# EAGLE design motorBoard (EAGLE 8.2.0)
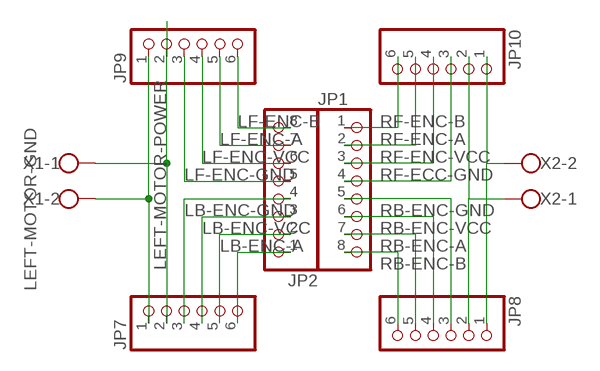
[diagram p0: schematic, sheet 1]

## Parts
JP1  PINHD-1X8  [1X08]
JP2  PINHD-1X8  [1X08]
JP7  PINHD-1X6  [1X06]
JP8  PINHD-1X6  [1X06]
JP9  PINHD-1X6  [1X06]
JP10  PINHD-1X6  [1X06]
X1  W237-102  [W237-102]
X2  W237-102  [W237-102]

## Nets
LB-ENC-A: JP2.2 JP7.5
LB-ENC-B: JP2.1 JP7.6
LB-ENC-GND: JP2.4 JP7.3
LB-ENC-VCC: JP2.3 JP7.4
LEFT-MOTOR-GND: JP7.2 JP9.2 X1.1
LEFT-MOTOR-POWER: JP7.1 JP9.1 X1.2
LF-ENC-A: JP2.7 JP9.5
LF-ENC-B: JP2.8 JP9.6
LF-ENC-GND: JP2.5 JP9.3
LF-ENC-VCC: JP2.6 JP9.4
N$1: JP8.1 JP10.1 X2.2
N$2: JP8.2 JP10.2 X2.1
RB-ENC-A: JP1.7 JP8.5
RB-ENC-B: JP1.8 JP8.6
RB-ENC-GND: JP1.5 JP8.3
RB-ENC-VCC: JP1.6 JP8.4
RF-ECC-GND: JP1.4 JP10.3
RF-ENC-A: JP1.2 JP10.5
RF-ENC-B: JP1.1 JP10.6
RF-ENC-VCC: JP1.3 JP10.4

## Library data of the parts
JP1 JP2 = pinhead:PINHD-1X8: PIN HEADER
JP7-JP10 = pinhead:PINHD-1X6: PIN HEADER
X1 X2 = con-wago-500:W237-102: WAGO SCREW CLAMP; MPN: 237-102; OC_FARNELL: unknown; OC_NEWARK: 70K9898

## Board
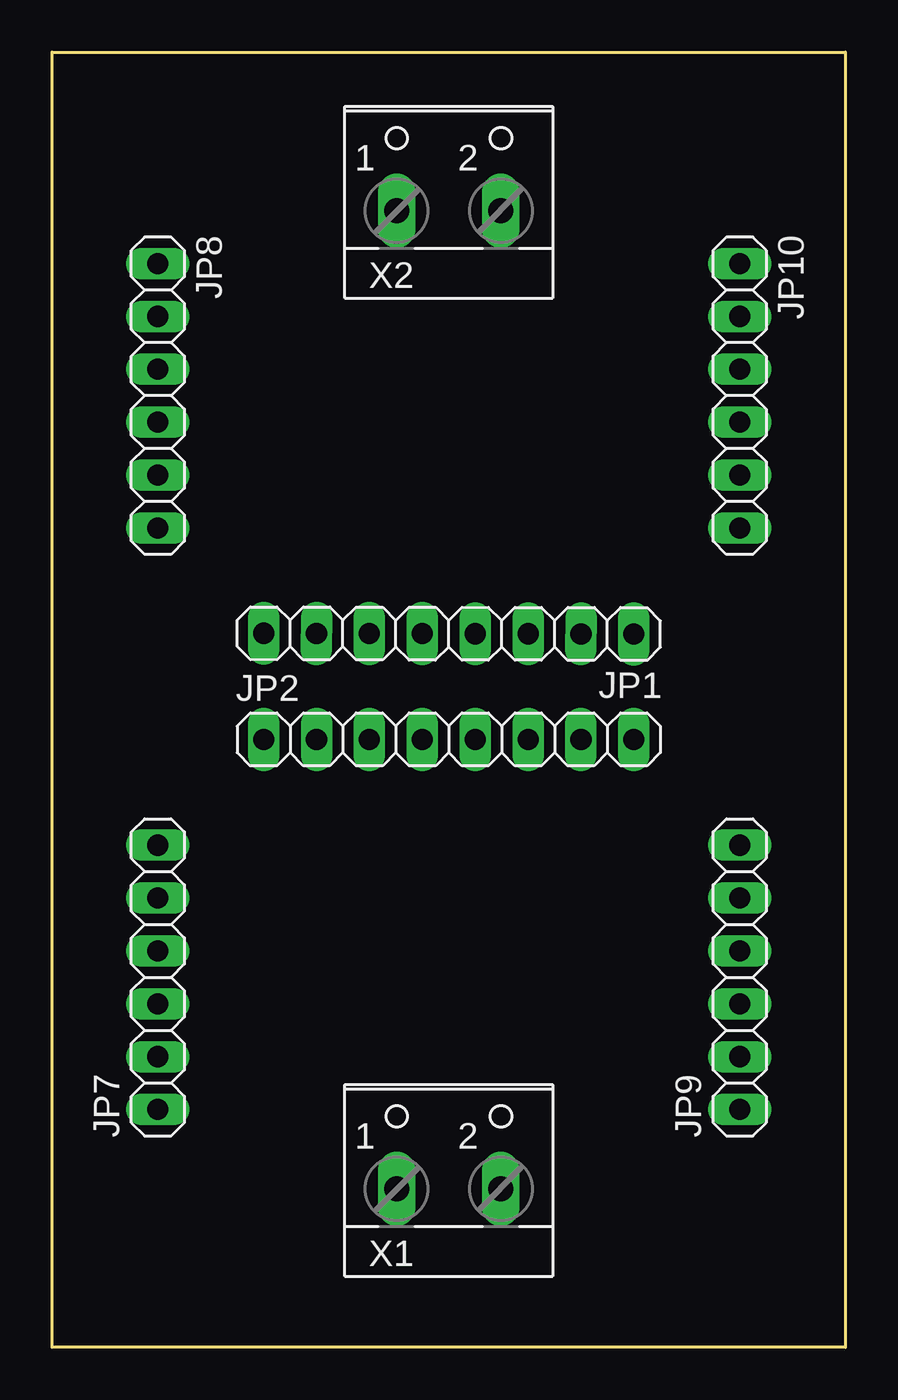
[diagram p1: board, top side]
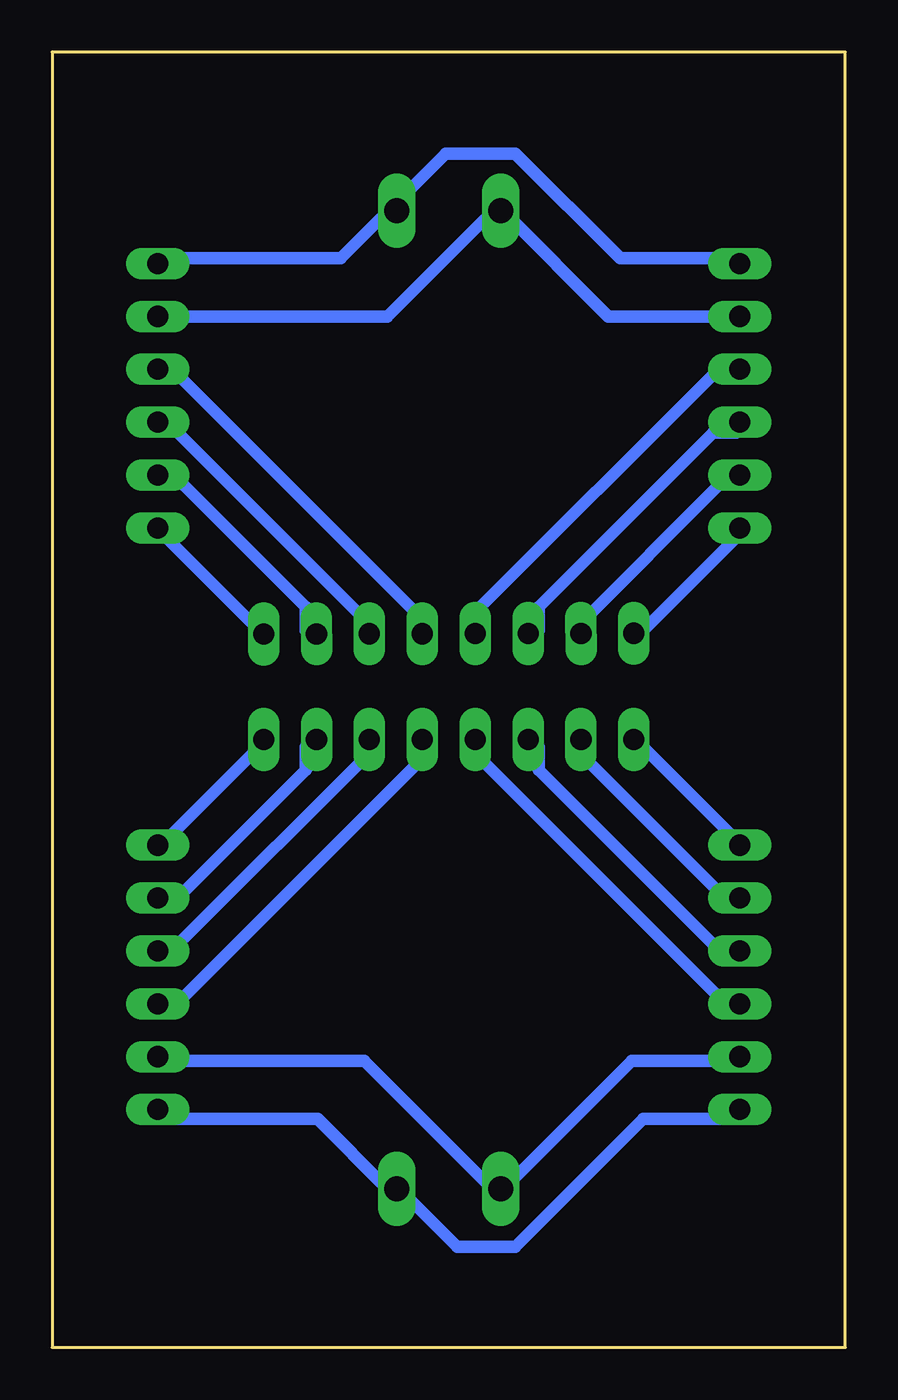
[diagram p2: board, bottom side, seen from below]

Size 38.1 x 62.23 mm. Coordinates in mm from the lower left corner, seen from the top.
Outline: 0,62.23 38.1,62.23 38.1,0 0,0 0,62.23
Copper layers (1*16): Top 0.035mm / dielectric 1.5mm / Bottom 0.035mm
Design rules "default *": minimum track width 24mil, minimum drill 20mil, track to track 20mil, track to pad 20mil, pad to pad 20mil, via to via 20mil, smd to smd 0mil, copper to edge 40mil, drill to drill 6mil, minimum pad ring 10mil, minimum via ring 8mil, stop-mask expansion 4mil, vias tented up to drill 0mil, thermal gap 10mil

### Footprints (pad centres in the part's own frame; a part is rotated, then mirrored left to right if it is on the bottom)
1X08 = drill 1.016 long: 1 -8.89,0; 2 -6.35,0; 3 -3.81,0; 4 -1.27,0; 5 1.27,0; 6 3.81,0; 7 6.35,0; 8 8.89,0
1X06 = drill 1.016 long: 1 -6.35,0; 2 -3.81,0; 3 -1.27,0; 4 1.27,0; 5 3.81,0; 6 6.35,0
W237-102 = drill 1.194 long: 1 -2.5,-1.27; 2 2.5,-1.27

### Placement (x,y rotation side)
JP1  19.05,34.29 179.9 top
JP2  19.05,29.21 0 top
JP7  5.08,17.78 90 top
JP8  5.08,45.72 270 top
JP9  33.02,17.78 90 top
JP10  33.02,45.72 270 top
X1  19.05,8.89 0 top
X2  19.05,55.88 0 top

### Tracks (layer width: path | path; a pad name or v marks a point on that pad's centre or on a via)
LB-ENC-A
  Bottom 0.61: JP2.2 13.06,28.85 5.79,21.59 JP7.5
LB-ENC-B
  Bottom 0.61: JP7.6 5.23,24.38 9.7,28.85 JP2.1
LB-ENC-GND
  Bottom 0.61: JP7.3 5.23,16.56 5.79,16.56 18.08,28.85 JP2.4
LB-ENC-VCC
  Bottom 0.61: JP2.3 14.73,28.85 14.73,27.74 6.35,19.35 5.23,19.35 JP7.4
LEFT-MOTOR-GND
  Bottom 0.61: JP7.2 5.23,13.77 10.26,13.77 16.41,7.62 X1.1 16.97,7.62 23.11,13.77 32.61,13.77 JP9.2
LEFT-MOTOR-POWER
  Bottom 0.61: JP7.1 5.23,10.97 9.7,10.97 15.85,4.83 18.64,4.83 21.44,7.62 X1.2 22,7.62 25.35,10.97 32.61,10.97 JP9.1
LF-ENC-A
  Bottom 0.61: JP9.5 32.06,21.59 25.91,27.74 25.91,28.85 JP2.7
LF-ENC-B
  Bottom 0.61: JP9.6 32.61,24.38 28.14,28.85 JP2.8
LF-ENC-GND
  Bottom 0.61: JP2.5 20.32,28.3 32.06,16.56 32.61,16.56 JP9.3
LF-ENC-VCC
  Bottom 0.61: JP9.4 32.61,19.35 32.06,19.35 22.56,28.85 JP2.6
N$1
  Bottom 0.61: JP8.1 5.23,52.32 10.82,52.32 15.85,57.35 19.2,57.35 21.44,55.12 X2.2 22,54.56 24.23,52.32 32.61,52.32 JP10.1
N$2
  Bottom 0.61: JP10.2 22,49.53 16.97,54.56 X2.1 16.41,54.56 11.38,49.53 JP8.2
RB-ENC-A
  Bottom 0.61: JP1.7 13.06,34.44 5.79,41.71 5.23,41.71 JP8.5
RB-ENC-B
  Bottom 0.61: JP8.6 5.23,38.91 9.7,34.44 JP1.8
RB-ENC-GND
  Bottom 0.61: JP8.3 5.23,46.74 6.35,46.74 17.53,35.56 17.53,34.44 JP1.5
RB-ENC-VCC
  Bottom 0.61: JP1.6 14.73,34.44 14.73,35.56 6.35,43.94 5.23,43.94 JP8.4
RF-ECC-GND
  Bottom 0.61: JP1.4 20.32,34.44 20.32,35 32.61,47.3 JP10.3
RF-ENC-A
  Bottom 0.61: JP1.2 25.91,34.44 25.91,35.56 32.61,42.27 JP10.5
RF-ENC-B
  Bottom 0.61: JP1.1 28.14,34.44 32.61,38.91 JP10.6
RF-ENC-VCC
  Bottom 0.61: JP1.3 23.11,34.44 23.11,35 32.61,44.5 JP10.4